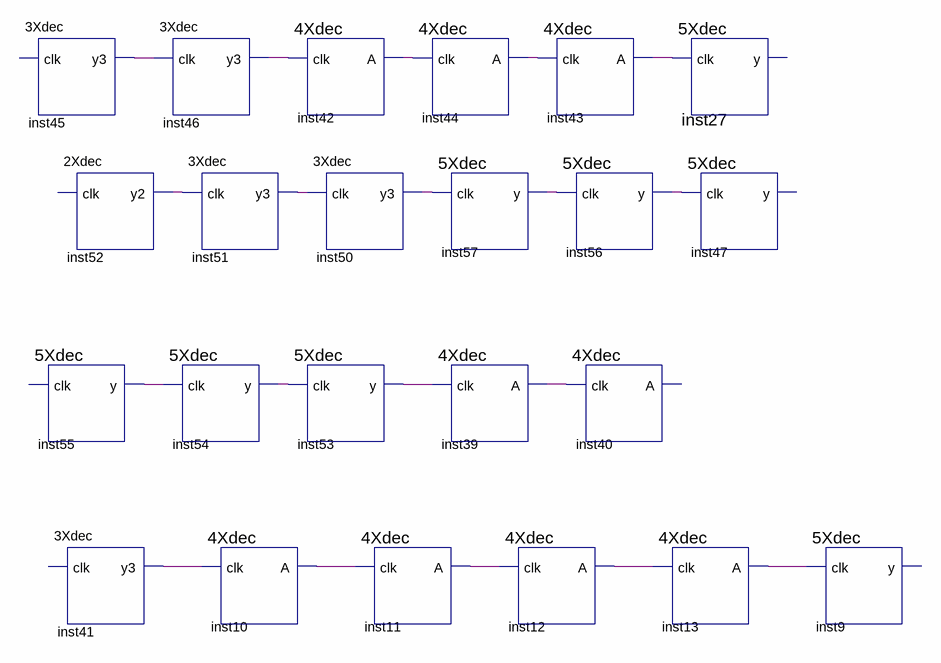
[diagram p0: schematic sheet]
// Quartus schematic Block1.bdf as structural Verilog: 23 symbols, 0 pins
module Block1 (
);

  wire inst10_a, inst11_a, inst12_a, inst13_a, inst39_a, inst41_y3, inst42_a, inst43_a, inst44_a, inst45_y3,
       inst46_y3, inst50_y3, inst51_y3, inst52_y2, inst53_y, inst54_y, inst55_y, inst56_y, inst57_y;

  \3Xdec  inst45 (.y3(inst45_y3));  // open: clk
  \5Xdec  inst55 (.y(inst55_y));  // open: clk
  \3Xdec  inst41 (.y3(inst41_y3));  // open: clk
  \2Xdec  inst52 (.y2(inst52_y2));  // open: clk
  \3Xdec  inst46 (.clk(inst45_y3), .y3(inst46_y3));
  \3Xdec  inst51 (.clk(inst52_y2), .y3(inst51_y3));
  \5Xdec  inst54 (.clk(inst55_y), .y(inst54_y));
  \4Xdec  inst10 (.clk(inst41_y3), .A(inst10_a));
  \4Xdec  inst42 (.clk(inst46_y3), .A(inst42_a));
  \3Xdec  inst50 (.clk(inst51_y3), .y3(inst50_y3));
  \5Xdec  inst53 (.clk(inst54_y), .y(inst53_y));
  \4Xdec  inst11 (.clk(inst10_a), .A(inst11_a));
  \4Xdec  inst44 (.clk(inst42_a), .A(inst44_a));
  \5Xdec  inst57 (.clk(inst50_y3), .y(inst57_y));
  \4Xdec  inst39 (.clk(inst53_y), .A(inst39_a));
  \4Xdec  inst12 (.clk(inst11_a), .A(inst12_a));
  \4Xdec  inst43 (.clk(inst44_a), .A(inst43_a));
  \5Xdec  inst56 (.clk(inst57_y), .y(inst56_y));
  \4Xdec  inst40 (.clk(inst39_a));  // open: A
  \4Xdec  inst13 (.clk(inst12_a), .A(inst13_a));
  \5Xdec  inst27 (.clk(inst43_a));  // open: y
  \5Xdec  inst47 (.clk(inst56_y));  // open: y
  \5Xdec  inst9 (.clk(inst13_a));  // open: y
endmodule
